# Altium schematic sheet PeripheralConnector.SchDoc
size A; SheetNumber: 7; SheetTotal: 11
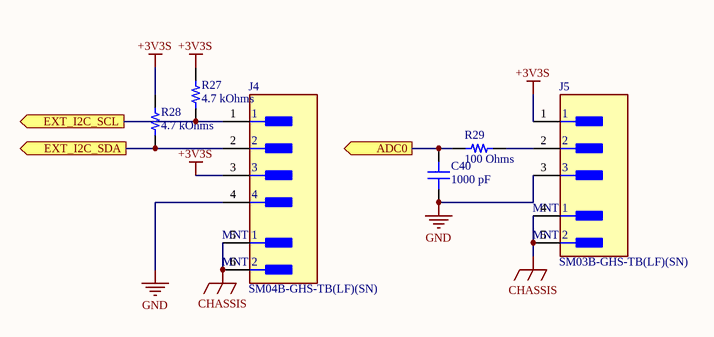
[diagram p0: PeripheralConnector.SchDoc]

## Parts
C40  1000 pF  [CAP 0402_1005]
J4  SM04B-GHS-TB(LF)(SN)  [FP-SM04B-GHS-TB_LF_SN-MFG]
J5  SM03B-GHS-TB(LF)(SN)  [FP-SM03B-GHS-TB_LF_SN-MFG]
R27  4.7 kOhms  [RES 0402_1005]
R28  4.7 kOhms  [RES 0402_1005]
R29  100 Ohms  [RES 0402_1005]

## Ports
ADC0 (out), EXT_I2C_SCL (out), EXT_I2C_SDA (out)

## Nets
+3V3S: J4.3 J5.1 R27.2 R28.2
CHASSIS: J4.5(MNT_1) J4.6(MNT_2) J5.4(MNT_1) J5.5(MNT_2)
GND: C40.1 J4.4 J5.3
ADC0: C40.2 R29.1 ; port ADC0
EXT_I2C_SCL: J4.1 R27.1 ; port EXT_I2C_SCL
EXT_I2C_SDA: J4.2 R28.1 ; port EXT_I2C_SDA
NetJ5_2: J5.2 R29.2

## Library data of the parts
C40 = UMK105CG102JVHF: CAP CER 1000PF 50V C0G/NP0 0402; manufacturer: Taiyo Yuden; Temperature Coefficient: C0G, NP0; Tolerance: ±5%; Part Number: UMK105CG102JVHF; Capacitance: 1000 pF; Applications: Automotive; componentlink1description: Datasheet; componentlink1url: https://ds.yuden.co.jp/TYCOMPAS/ut/detail?pn=UMK105CG102JVHF &u=M; componentlink2description: DigiKey Link; componentlink2url: https://www.digikey.com/en/products/detail/taiyo-yuden/UMK105CG102JVHF/4811103; Device Package: 0402 (1005 Metric); lastupdated: 2/9/2024 8:04:38 PM; Lifecycle Status: Active; Minimum Order: 1; Mounting Type: Surface Mount, MLCC; Operating Temperature: -55°C ~ 125°C; Package / Case: 0402 (1005 Metric); packaging: TapeAndReel; partid: 1779; Part Status: Active; price: 0.01; Ratings: AEC-Q200; series: M; Size / Dimension: 0.039" L x 0.020" W (1.00mm x 0.50mm); Supplier 1: DigiKey; Supplier Part Number 1: 587-3737-1-ND; Thickness (Max): 0.022" (0.55mm); value: 1000 pF; Voltage - Rated: 50V
J4 = CMP-17439-000411-1: CONN HEADER SMD R/A 4POS 1.25MM; Voltage Rating: 50V; Number of Contacts: 4; Current Rating: 1A; Termination: Solder; Mount: Surface Mount; REACH SVHC: No SVHC; Packaging: Cut Tape; Contact Material: Bronze; Series: GH; Orientation: Right Angle; Lead Free: Lead Free; Housing Material: Nylon; Contact Plating: Tin; Housing Color: Natural; Number of Rows: 1; Pitch: 1.25mm; Number of Positions: 4
J5 = CMP-17439-000068-1: CONN HEADER SMD R/A 3POS 1.25MM; Voltage Rating: 50V; Wire/Cable Gauge: 26AWG; Pitch: 0.049inch; Gender: Male; Number of Positions: 3; Current Rating: 1A; Orientation: Right Angle; REACH SVHC: No SVHC; Insulation Color: Natural; Housing Material: Nylon; Mount: Surface Mount; Flammability Rating: UL94 V-0; Color: Natural; Number of Rows: 1; Housing Color: Natural; Termination: Solder; Voltage Rating (AC): 50V; Max Operating Temperature: 85°C; Connector Type: Header; Series: GH; Packaging: Tape and Reel; Contact Finish - Mating: TIN; Lead Free: Lead Free; Fastening Type: Ramp; Contact Plating: Tin; Contact Material: Bronze; Insulation Material: Nylon; Contact Type: Outer Shroud Contact; Number of Contacts: 3; Min Operating Temperature: -25°C; Contact Shape: Rectangular
R27 R28 = WR04X4701FTL: RES 4.7K OHM 1% 1/16W 0402; Manufacturer: Walsin Technology Corporation; Power (Watts): 0.063W, 1/16W; Temperature Coefficient: ±100ppm/°C; Part Number: WR04X4701FTL; Value: 4.7 kOhms; ComponentLink1Description: Datasheet; ComponentLink1URL: https://www.passivecomponent.com/wp-content/uploads/chipR/ASC_WR.pdf; ComponentLink2Description: DigiKey Link; ComponentLink2URL: https://www.digikey.com/en/products/detail/walsin-technology-corporation/WR04X4701FTL/13239186; Composition: Thick Film; Device Package: 0402 (1005 Metric); Height - Seated (Max): 0.016" (0.40mm); LastUpdated: 2/9/2024 8:28:34 PM; Lifecycle Status: Active; Minimum Order: 1; Number of Terminations: 2; Operating Temperature: -55°C ~ 155°C; Package / Case: 0402 (1005 Metric); Packaging: CutTape; PartId: 77487; Part Status: Active; Price: 0.01; Resistance: 4.7 kOhms; Series: WR; Size / Dimension: 0.039" L x 0.020" W (1.00mm x 0.50mm); Supplier 1: DigiKey; Supplier Part Number 1: 1292-WR04X4701FTLCT-ND; Supplier Device Package: 0402; Tolerance: ±1%
R29 = WR04X1000FTL: RES 100 OHM 1% 1/16W 0402; Manufacturer: Walsin Technology Corporation; Power (Watts): 0.063W, 1/16W; Temperature Coefficient: ±100ppm/°C; Part Number: WR04X1000FTL; Value: 100 Ohms; ComponentLink1Description: Datasheet; ComponentLink1URL: https://www.passivecomponent.com/wp-content/uploads/chipR/ASC_WR.pdf; ComponentLink2Description: DigiKey Link; ComponentLink2URL: https://www.digikey.com/en/products/detail/walsin-technology-corporation/WR04X1000FTL/13241075; Composition: Thick Film; Device Package: 0402 (1005 Metric); Height - Seated (Max): 0.016" (0.40mm); LastUpdated: 2/9/2024 8:28:55 PM; Lifecycle Status: Active; Minimum Order: 1; Number of Terminations: 2; Operating Temperature: -55°C ~ 155°C; Package / Case: 0402 (1005 Metric); Packaging: CutTape; PartId: 64787; Part Status: Active; Price: 0.01; Resistance: 100 Ohms; Series: WR; Size / Dimension: 0.039" L x 0.020" W (1.00mm x 0.50mm); Supplier 1: DigiKey; Supplier Part Number 1: 1292-WR04X1000FTLCT-ND; Supplier Device Package: 0402; Tolerance: ±1%